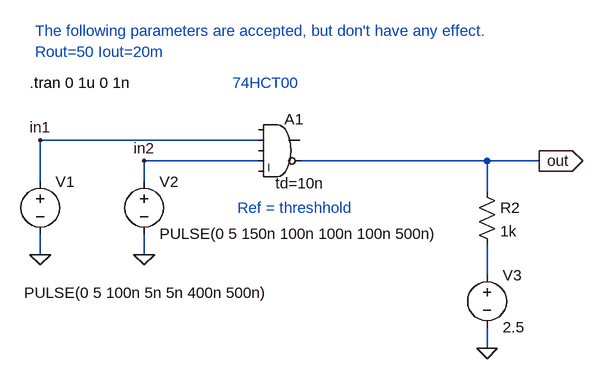
[diagram p0: schematic FirstAnd.asc]
FirstAnd.asc, the LTspice schematic file:
Version 4
SHEET 1 996 680
WIRE -288 208 -288 144
WIRE -288 320 -288 288
WIRE -128 208 -128 176
WIRE -128 320 -128 288
WIRE 48 144 -288 144
WIRE 48 176 -128 176
WIRE 400 176 112 176
WIRE 400 224 400 176
WIRE 400 352 400 304
WIRE 400 464 400 432
WIRE 480 176 400 176
FLAG -288 320 0
FLAG -128 320 0
FLAG 480 176 out
IOPIN 480 176 Out
FLAG -288 144 in1
FLAG -128 176 in2
FLAG 400 464 0
SYMBOL Digital\\and 80 96 R0
WINDOW 3 -6 114 Left 0
SYMATTR Value td=10n
SYMATTR InstName A1
SYMATTR Value2 trise=10n tfall=10n
SYMATTR SpiceLine vhigh=5 Ref=1.5
SYMBOL voltage -288 192 R0
WINDOW 3 -25 187 Left 0
WINDOW 123 0 0 Left 0
WINDOW 39 0 0 Left 0
SYMATTR Value PULSE(0 5 100n 5n 5n 400n 500n)
SYMATTR InstName V1
SYMBOL voltage -128 192 R0
WINDOW 123 0 0 Left 0
WINDOW 39 0 0 Left 0
SYMATTR InstName V2
SYMATTR Value PULSE(0 5 150n 100n 100n 100n 500n)
SYMBOL res 384 208 R0
SYMATTR InstName R2
SYMATTR Value 1k
SYMBOL voltage 400 336 R0
SYMATTR InstName V3
SYMATTR Value 2.5
TEXT -304 56 Left 0 !.tran 0 1u 0 1n
TEXT 8 56 Left 0 ;74HCT00
TEXT -296 -24 Left 0 ;The following parameters are accepted, but don't have any effect.
TEXT -296 8 Left 0 ;Rout=50 Iout=20m
TEXT 16 248 Left 0 ;Ref = threshhold

The netlist it stands for:
* FirstAnd.asc
A1 0 in1 0 in2 0 out 0 0 AND td=10n trise=10n tfall=10n vhigh=5 Ref=1.5
V1 in1 0 PULSE(0 5 100n 5n 5n 400n 500n)
V2 in2 0 PULSE(0 5 150n 100n 100n 100n 500n)
R2 out N001 1k
V3 N001 0 2.5
.tran 0 1u 0 1n
* 74HCT00
* The following parameters are accepted, but don't have any effect.
* Rout=50 Iout=20m
* Ref = threshhold
.backanno
.end